# Altium schematic sheet MAIN.SchDoc
size 386 x 246 mm
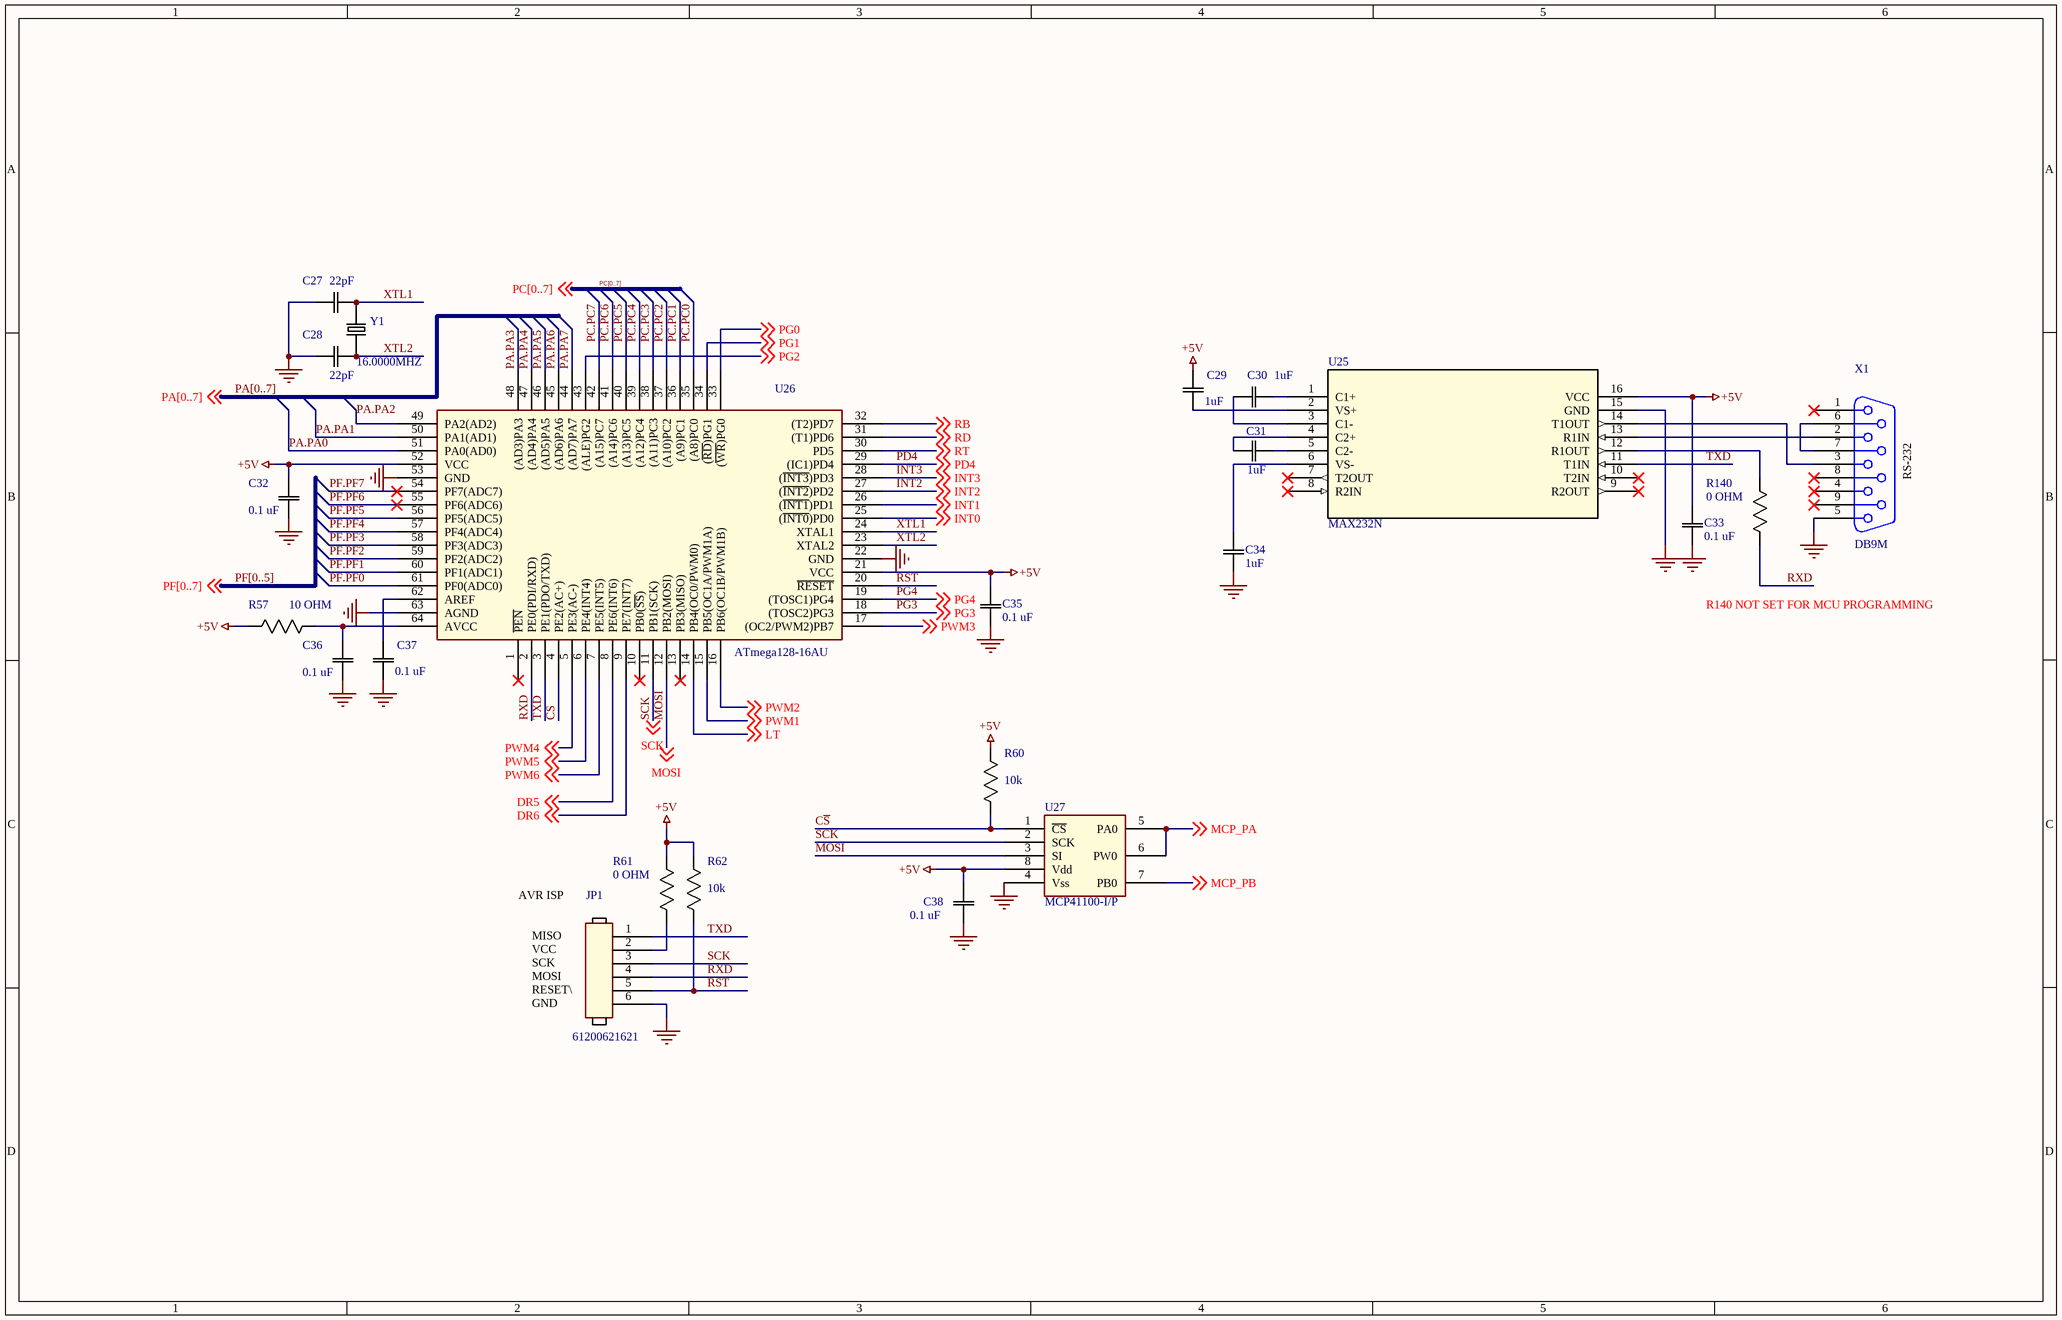
[diagram p0: MAIN.SchDoc]

## Parts
C27  22pF  [SR20]
C28  22pF  [SR20]
C29  1uF  [SR20]
C30  1uF  [SR20]
C31  1uF  [SR20]
C32  0.1 uF  [SR20]
C33  0.1 uF  [SR20]
C34  1uF  [SR20]
C35  0.1 uF  [SR20]
C36  0.1 uF  [SR20]
C37  0.1 uF  [SR20]
C38  0.1 uF  [SR20]
JP1  61200621621  [BLKCON.100/VH/TM2OE/W.200/6]
R57  10 OHM  [RES AXIAL 1/6W]
R60  10k  [RES AXIAL 1/6W]
R61  0 OHM  [RES AXIAL 1/6W]
R62  10k  [RES AXIAL 1/6W]
R140  0 OHM  [RES AXIAL 1/6W]
U25  MAX232N  [N16]
U26  ATmega128-16AU  [QUAD.80M/64/WG16.00]
U27  MCP41100-I/P  [*DIP254P762X508-8]
X1  DB9M  [DSUB/RP.318/TM/9]
Y1  16.0000MHZ  [HC-49/US]

## Nets
+5V: C29.1 C32.2 C33.2 C35.2 C38.2 R57.2 R60.2 R61.2 R62.2 U25.16(VCC) U26.21(VCC) U26.52(VCC) U27.8(Vdd)
GND: C27.1 C28.1 C32.1 C33.1 C34.2 C35.1 C36.1 C37.1 C38.1 JP1.6 U25.15(GND) U26.22(GND) U26.53(GND) U26.63(AGND) U27.4(Vss) X1.5
C~{S}: R60.1 U26.4(PE2(AC+)) U27.1(~{CS})
DR5: U26.8(PE6(INT6)) ; off-sheet DR5
DR6: U26.9(PE7(INT7)) ; off-sheet DR6
INT0: U26.25((~{INT0})PD0) ; off-sheet INT0
INT1: U26.26((~{INT1})PD1) ; off-sheet INT1
INT2: U26.27((~{INT2})PD2) ; off-sheet INT2
INT3: U26.28((~{INT3})PD3) ; off-sheet INT3
LT: U26.14(PB4(OC0/PWM0)) ; off-sheet LT
MCP_PA: U27.5(PA0) U27.6(PW0) ; off-sheet MCP_PA
MCP_PB: U27.7(PB0) ; off-sheet MCP_PB
MOSI: U26.12(PB2(MOSI)) U27.3(SI) ; off-sheet MOSI
PA.PA0: U26.51(PA0(AD0))
PA.PA1: U26.50(PA1(AD1))
PA.PA2: U26.49(PA2(AD2))
PA.PA3: U26.48((AD3)PA3)
PA.PA4: U26.47((AD4)PA4)
PA.PA5: U26.46((AD5)PA5)
PA.PA6: U26.45((AD6)PA6)
PA.PA7: U26.44((AD7)PA7)
PC.PC0: U26.35((A8)PC0)
PC.PC1: U26.36((A9)PC1)
PC.PC2: U26.37((A10)PC2)
PC.PC3: U26.38((A11)PC3)
PC.PC4: U26.39((A12)PC4)
PC.PC5: U26.40((A13)PC5)
PC.PC6: U26.41((A14)PC6)
PC.PC7: U26.42((A15)PC7)
PD4: U26.29((IC1)PD4) ; off-sheet PD4
PF.PF0: U26.61(PF0(ADC0))
PF.PF1: U26.60(PF1(ADC1))
PF.PF2: U26.59(PF2(ADC2))
PF.PF3: U26.58(PF3(ADC3))
PF.PF4: U26.57(PF4(ADC4))
PF.PF5: U26.56(PF5(ADC5))
PF.PF6: U26.55(PF6(ADC6))
PF.PF7: U26.54(PF7(ADC7))
PG0: U26.33((~{WR})PG0) ; off-sheet PG0
PG1: U26.34((~{RD})PG1) ; off-sheet PG1
PG2: U26.43((ALE)PG2) ; off-sheet PG2
PG3: U26.18((TOSC2)PG3) ; off-sheet PG3
PG4: U26.19((TOSC1)PG4) ; off-sheet PG4
PWM1: U26.15(PB5(OC1A/PWM1A)) ; off-sheet PWM1
PWM2: U26.16(PB6(OC1B/PWM1B)) ; off-sheet PWM2
PWM3: U26.17((OC2/PWM2)PB7) ; off-sheet PWM3
PWM4: U26.5(PE3(AC-)) ; off-sheet PWM4
PWM5: U26.6(PE4(INT4)) ; off-sheet PWM5
PWM6: U26.7(PE5(INT5)) ; off-sheet PWM6
RB: U26.32((T2)PD7) ; off-sheet RB
RD: U26.31((T1)PD6) ; off-sheet RD
RS~{T}: JP1.5 R62.1 U26.20(~{RESET})
RT: U26.30(PD5) ; off-sheet RT
RXD: JP1.4 R140.1 U26.2(PE0(PDI/RXD))
SCK: JP1.3 U26.11(PB1(SCK)) U27.2(SCK) ; off-sheet SCK
TXD: JP1.1 U25.11(T1IN) U26.3(PE1(PDO/TXD))
XTL1: C27.2 U26.24(XTAL1) Y1.1
XTL2: C28.2 U26.23(XTAL2) Y1.2
NetC29_2: C29.2 U25.2(VS+)
NetC30_1: C30.1 U25.1(C1+)
NetC30_2: C30.2 U25.3(C1-)
NetC31_1: C31.1 U25.5(C2-)
NetC31_2: C31.2 U25.4(C2+)
NetC34_1: C34.1 U25.6(VS-)
NetC36_2: C36.2 R57.1 U26.64(AVCC)
NetC37_2: C37.2 U26.62(AREF)
NetJP1_2: JP1.2 R61.1
NetR140_2: R140.2 U25.12(R1OUT)
NetU25_13: U25.13(R1IN) X1.2
NetU25_14: U25.14(T1OUT) X1.3
NetX1_6: X1.6 X1.7

Not connected (* = marked no-connect by the designer): U25 7(T2OUT)* 8(R2IN)* 9(R2OUT)* 10(T2IN)*; U26 1(~{PEN})* 10(PB0(~{SS}))* 13(PB3(MISO))*; X1 1* 4* 8* 9*

## Buses and harness runs
bus PA[0..7]
bus PC[0..7]
bus PF[0..5]

## Notes on the sheet
- (near X1) RS-232
- R140 NOT SET FOR MCU PROGRAMMING
- AVR ISP
- MISO
- VCC
- SCK
- MOSI
- (near JP1) RESET\
- GND

## Library data of the parts
C27 C28 = CAP RADIAL 2.54: 22pF ±5% 50V Ceramic Capacitor C0G, NP0 Radial; Manufacturer_Part_Number: C315C220J5G5TA; Vendor: KEMET; Type: DEV; RefDes: RefDes; Value: 22pF
C29-C31 C34 = CAP RADIAL 2.54: 1µF ±10% 25V Ceramic Capacitor X7R Radial; Manufacturer_Part_Number: C315C105K3R5TA; Vendor: KEMET; Type: DEV; RefDes: RefDes; Value: 1uF
C32 C33 C35-C38 = CAP RADIAL 2.54: 0.1µF ±10% 100V Ceramic Capacitor X7R Radial; Manufacturer_Part_Number: C320C104K1R5TA7301; Vendor: KEMET; Type: DEV; RefDes: RefDes; Value: 0.1 uF
JP1 = HEADER 6: Wire-To-Board Connector, WR-BHD Series, Through Hole, Header, 6, 2.54 mm, Gold Plated Contacts
R57 = Resistor Axial  1/6W: RES 10 OHM 1/6W 5% AXIAL; Manufacturer_Part_Number: CFR-12JB-52-10R; Vendor: Yageo; RefDes: RefDes; Type: DEV; Value: 10 OHM
R60 R62 = Resistor Axial  1/6W: RES 10K OHM 1/6W 5% AXIAL; Manufacturer_Part_Number: CFR-12JB-52-10K; Vendor: Yageo; RefDes: RefDes; Type: DEV; Value: 10k
R61 R140 = Resistor Axial  1/6W: RES 0 OHM 1/6W JUMP AXIAL; Manufacturer_Part_Number: ZOR-12-B-52-0R; Vendor: Yageo; RefDes: RefDes; Type: DEV; Value: 0 OHM
U25 = MAX232N: Imported; Vendor: Texas Instruments; Built_By: EMA_UL_Team; C: Copyright (C) 2015 Accelerated Designs. All rights reserved; Manufacturer_Part_Number: MAX232N; RefDes: RefDes; Type: DEV; Value: Value
U26 = ATMega103_1
U27 = MCP41100-I/P: IC POT DGTL 100K 2CH SPI 14-DIP
X1 = CONNECTOR DB9
Y1 = CRYSTAL HC-49/US: 16MHz ±30ppm Crystal 20pF 40 Ohms HC-49/US; Manufacturer_Part_Number: ECS-160-20-4X; Value: 16.0000MHZ